# EAGLE design SNES-3Chip_MR_QID (EAGLE 7.5.0)
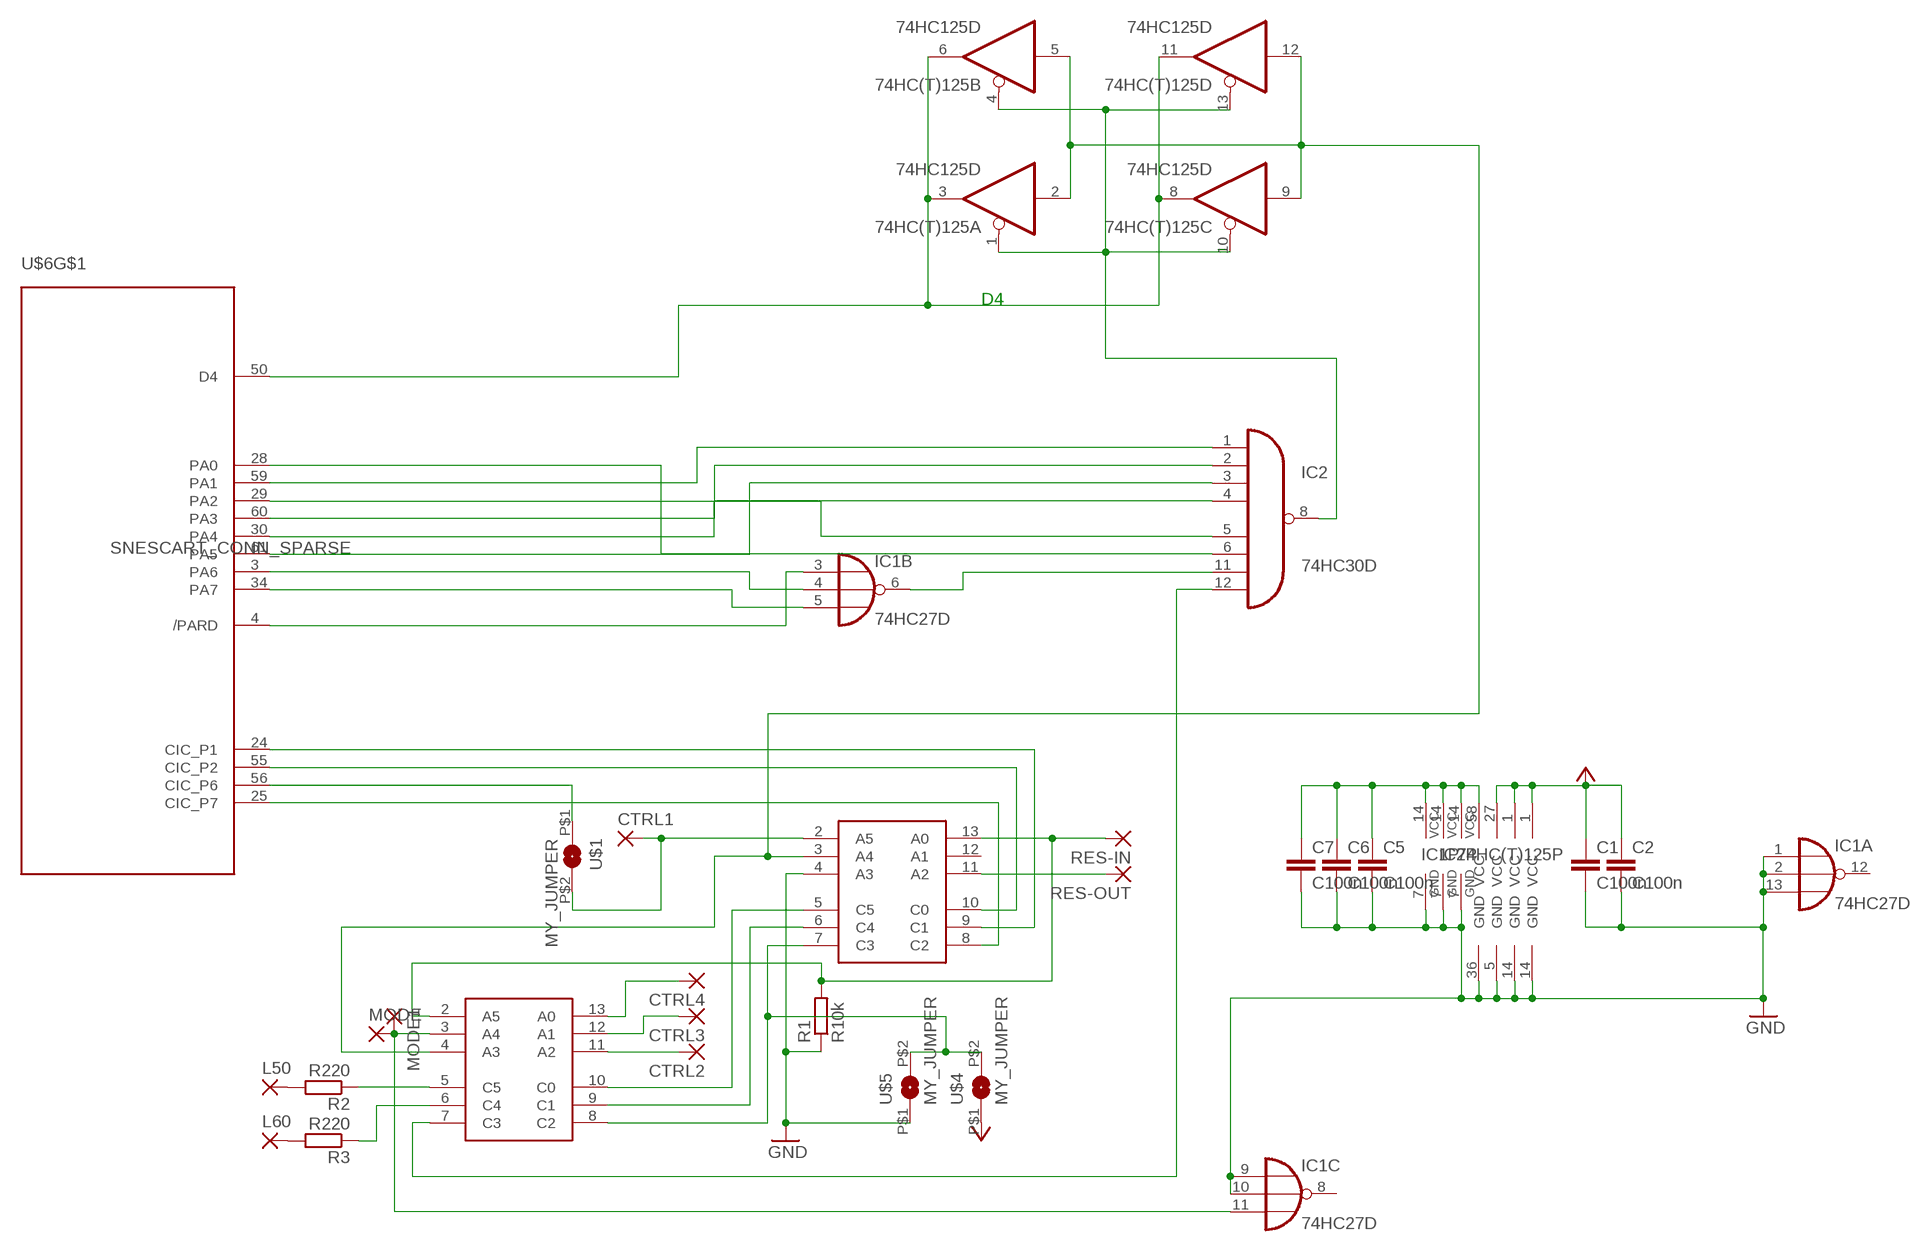
[diagram p0: schematic, sheet 1]

## Parts
74HC(T)125  74HC125D  [SO14]
C1  C100n  C0805  [Z0805]
C2  C100n  C0805  [Z0805]
C5  C100n  C0805  [Z0805]
C6  C100n  C0805  [Z0805]
C7  C100n  C0805  [Z0805]
CTRL1  SMD2  [SMD1,27-2,54]
CTRL2  SMD2  [SMD1,27-2,54]
CTRL3  SMD2  [SMD1,27-2,54]
CTRL4  SMD2  [SMD1,27-2,54]
IC1  74HC27D  [SO14]
IC2  74HC30D  [SO14]
L50  SMD2  [SMD1,27-2,54]
L60  SMD2  [SMD1,27-2,54]
MODE  SMD2  [SMD1,27-2,54]
MODE1  SMD2  [SMD1,27-2,54]
R1  R10k  R0805  [Z0805]
R2  R220  R0805  [Z0805]
R3  R220  R0805  [Z0805]
RES-IN  SMD2  [SMD1,27-2,54]
RES-OUT  SMD2  [SMD1,27-2,54]
U$1  MY_JUMPER  [MYJUMP]
U$2  PIC16F630_SIMPLE  [PIC16F630]
U$3  PIC16F630_SIMPLE  [PIC16F630]
U$4  MY_JUMPER  [MYJUMP]
U$5  MY_JUMPER  [MYJUMP]
U$6  SNESCART_CONN_SPARSE  [SNESCART_CONN_SPARSE]

## Nets
GND: 74HC(T)125.7(P:GND) C1.2 C2.2 C5.2 C6.2 C7.2 IC1.1(A:I0) IC1.2(A:I1) IC1.7(P:GND) IC1.9(C:I0) IC1.10(C:I1) IC1.13(A:I2) IC2.7(GND) R1.1 U$2.4(A3) U$2.14(GND) U$3.14(GND) U$5.P$1 U$6.5(GND) U$6.36(GND)
N$2: 74HC(T)125.1(A:OE) 74HC(T)125.4(B:OE) 74HC(T)125.10(C:OE) 74HC(T)125.13(D:OE) IC2.8(O)
N$3: RES-OUT.1(P) U$2.11(A2)
N$4: IC2.3(I2) U$6.61(PA5)
N$5: IC2.2(I1) U$6.60(PA3)
N$6: IC1.3(B:I0) U$6.4(/PARD)
N$7: IC1.4(B:I1) U$6.3(PA6)
N$8: IC1.6(B:O) IC2.11(I6)
N$9: IC2.6(I5) U$6.28(PA0)
N$10: R1.2 RES-IN.1(P) U$2.13(A0) U$3.2(A5)
N$11: L50.1(P) R2.2
N$12: R2.1 U$3.5(C5)
N$13: R3.1 U$3.6(C4)
N$14: IC1.11(C:I2) MODE1.1(P) MODE.1(P) U$3.3(A4)
N$15: L60.1(P) R3.2
N$16: IC1.5(B:I2) U$6.34(PA7)
N$17: IC2.12(I7) U$3.7(C3)
N$18: U$1.P$1 U$6.56(CIC_P6)
N$19: U$2.5(C5) U$3.10(C0)
N$20: IC2.1(I0) U$6.59(PA1)
N$21: IC2.5(I4) U$6.29(PA2)
N$22: IC2.4(I3) U$6.30(PA4)
N$33: CTRL2.1(P) U$3.11(A2)
N$34: CTRL3.1(P) U$3.12(A1)
N$39: CTRL1.1(P) U$1.P$2 U$2.2(A5)
N$42: 74HC(T)125.3(A:O) 74HC(T)125.6(B:O) 74HC(T)125.8(C:O) 74HC(T)125.11(D:O) U$6.50(D4)
N$46: CTRL4.1(P) U$3.13(A0)
N$48: U$2.10(C0) U$6.55(CIC_P2)
N$49: U$2.9(C1) U$6.24(CIC_P1)
N$51: U$2.8(C2) U$6.25(CIC_P7)
N$52: U$2.6(C4) U$3.9(C1)
N$53: U$2.7(C3) U$3.8(C2) U$4.P$2 U$5.P$2
UIGR: 74HC(T)125.2(A:I) 74HC(T)125.5(B:I) 74HC(T)125.9(C:I) 74HC(T)125.12(D:I) U$2.3(A4) U$3.4(A3)
VCC: C1.1 C2.1 U$2.1(VCC) U$3.1(VCC) U$4.P$1 U$6.27(VCC)
VCC_2: 74HC(T)125.14(P:VCC) C5.1 C6.1 C7.1 IC1.14(P:VCC) IC2.14(VCC) U$6.58(VCC)
Unconnected: IC1.8(C:O) IC1.12(A:O) U$2.12(A1)

## Notes on the sheet
- D4

## Library data of the parts
74HC(T)125 = 74xx-eu:74*125: Quad bus BUFFER, 3-state
C1 C2 C5-C7 = snescart:C0805
CTRL1-CTRL4 L50 L60 MODE MODE1 RES-IN RES-OUT = wirepad:SMD2: SMD PAD
IC1 = 74xx-eu:74*27: Triple 3-input NOR gate
IC2 = 74xx-eu:74*30: 8-input NAND gate
R1-R3 = snescart:R0805
U$1 U$4 U$5 = snescart:MY_JUMPER
U$2 U$3 = snescart:PIC16F630_SIMPLE
U$6 = snes_div:SNESCART_CONN_SPARSE

## Board
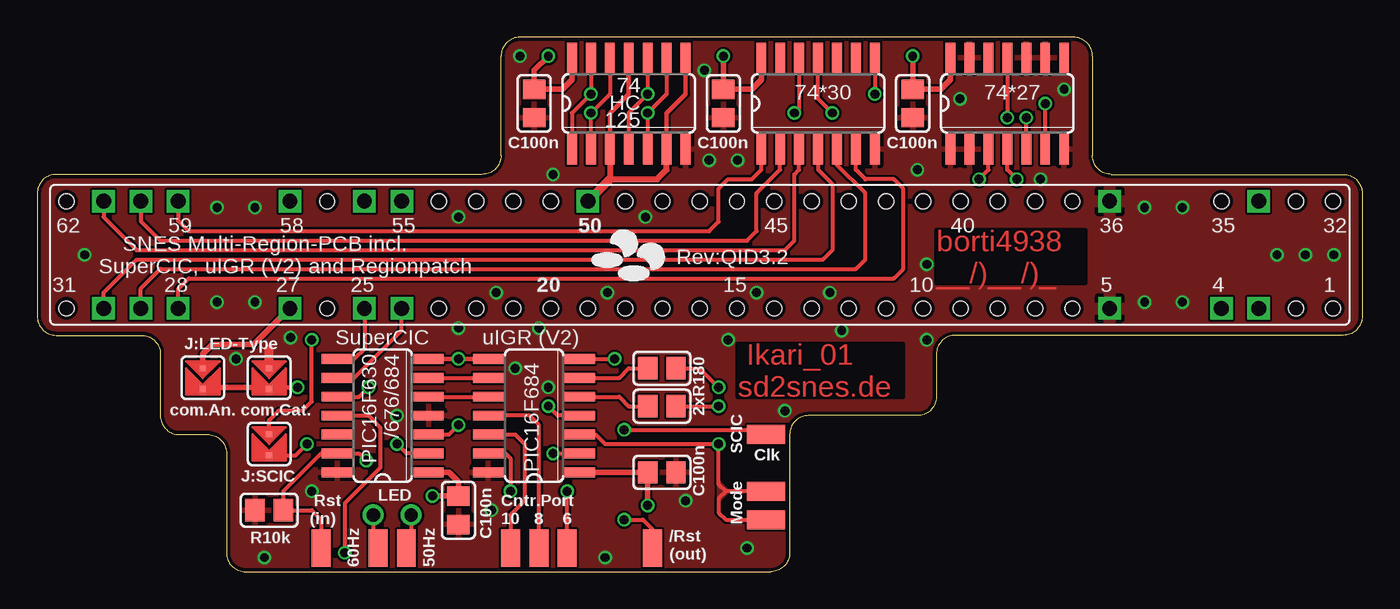
[diagram p1: board, top side]
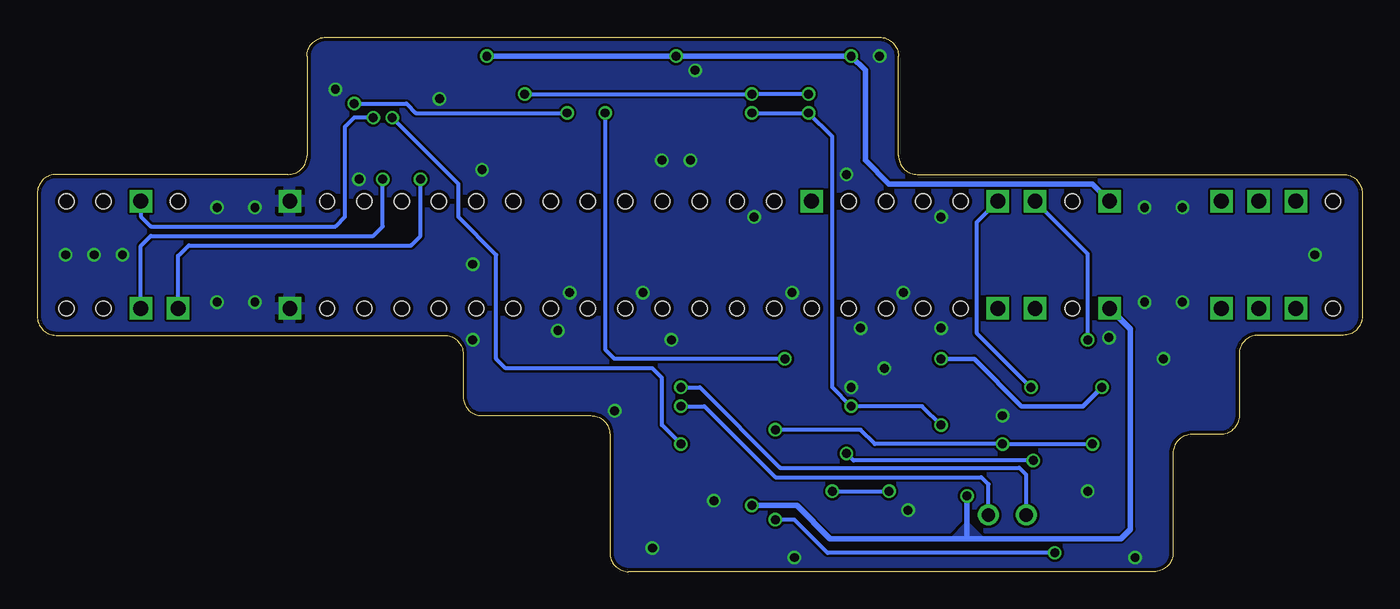
[diagram p2: board, bottom side, seen from below]

Size 88.9 x 35.88 mm. Coordinates in mm from the lower left corner, seen from the top.
Outline: 72.07,26.67 arc-90 70.8,27.94 70.8,34.61 arc90 69.53,35.88 32.38,35.88 arc90 31.11,34.61 31.11,27.94 arc-90 29.84,26.67 1.27,26.67 arc90 0,25.4 0,17.14 arc90 1.27,15.88 6.99,15.88 arc-90 8.26,14.61 8.26,10.48 arc90 9.53,9.21 11.43,9.21 arc-90 12.7,7.94 12.7,1.27 arc90 13.97,0 49.21,0 arc90 50.48,1.27 50.48,9.21 arc-90 51.75,10.48 59.05,10.48 arc90 60.32,11.75 60.32,14.61 arc-90 61.59,15.88 87.63,15.88 arc90 88.9,17.14 88.9,25.4 arc90 87.63,26.67 72.07,26.67
Copper layers (1*16): Top 0.035mm / dielectric 1.5mm / Bottom 0.035mm
Design rules "ITEADstudio_DRC": minimum track width 6mil, minimum drill 12mil, track to track 6mil, track to pad 6mil, pad to pad 6mil, via to via 6mil, smd to smd 0mil, copper to edge 10mil, drill to drill 10mil, minimum pad ring 10mil, minimum via ring 6mil, stop-mask expansion 2mil, vias tented up to drill 30mil, thermal gap 10mil
tRestrict: 3 lines

### Footprints (pad centres in the part's own frame; a part is rotated, then mirrored left to right if it is on the bottom)
SO14 = smd 0.66 x 2.032: 1 -3.81,-3.073; 2 -2.54,-3.073; 3 -1.27,-3.073; 4 0,-3.073; 5 1.27,-3.073; 6 2.54,-3.073; 7 3.81,-3.073; 8 3.81,3.073; 9 2.54,3.073; 10 1.27,3.073; 11 0,3.073; 12 -1.27,3.073; 13 -2.54,3.073; 14 -3.81,3.073
Z0805 = smd 1.3 x 1.5: 1 -0.95,0; 2 0.95,0
SMD1,27-2,54 = smd 1.27 x 2.54: 1 0,0
MYJUMP = smd 0.406 x 0.406: P$1 -0.635,0; P$2 0.765,0
PIC16F630 = smd 0.66 x 2.032: 1 -3.81,-3.073; 2 -2.54,-3.073; 3 -1.27,-3.073; 4 0,-3.073; 5 1.27,-3.073; 6 2.54,-3.073; 7 3.81,-3.073; 8 3.81,3.073; 9 2.54,3.073; 10 1.27,3.073; 11 0,3.073; 12 -1.27,3.073; 13 -2.54,3.073; 14 -3.81,3.073
SNESCART_CONN_SPARSE = drill 1 square: 3 -3.6,-37.5; 4 -3.6,-35; 5 -3.6,-27.5; 24 -3.6,20; 25 -3.6,22.5; 27 -3.6,27.5; 28 -3.6,35; 29 -3.6,37.5; 30 -3.6,40; 34 3.6,-37.5; 36 3.6,-27.5; 50 3.6,7.5; 55 3.6,20; 56 3.6,22.5; 58 3.6,27.5; 59 3.6,35; 60 3.6,37.5; 61 3.6,40 | hole 1: -3.6,-42.5; -3.6,-40; -3.6,-25; -3.6,-22.5; -3.6,-20; -3.6,-17.5; -3.6,-15; -3.6,-12.5; -3.6,-10; -3.6,-7.5; -3.6,-5; -3.6,-2.5; -3.6,0; -3.6,2.5; -3.6,5; -3.6,7.5; -3.6,10; -3.6,12.5; -3.6,15; -3.6,17.5; -3.6,25; -3.6,42.5; 3.6,42.5; 3.6,25; 3.6,17.5; 3.6,15; 3.6,12.5; 3.6,10; 3.6,5; 3.6,2.5; 3.6,0; 3.6,-2.5; 3.6,-5; 3.6,-7.5; 3.6,-10; 3.6,-12.5; 3.6,-15; 3.6,-17.5; 3.6,-20; 3.6,-22.5; 3.6,-25; 3.6,-35; 3.6,-40; 3.6,-42.5

### Placement (x,y rotation side)
74HC(T)125  39.69,31.43 0 top
C1  41.91,6.67 0 top
C2  28.26,4.13 270 top
C5  33.34,31.43 270 top
C6  46.04,31.43 270 top
C7  58.74,31.43 270 top
CTRL1  48.89,9.21 90 top
CTRL2  33.65,1.59 0 top
CTRL3  31.75,1.59 0 top
CTRL4  35.56,1.59 0 top
IC1  65.09,31.43 0 top
IC2  52.39,31.43 0 top
L50  24.77,1.59 0 top
L60  22.86,1.59 0 top
MODE  48.89,3.49 90 top
MODE1  48.89,5.4 90 top
R1  15.56,4.13 0 top
R2  41.91,11.11 0 top
R3  41.91,13.65 0 top
RES-IN  19.05,1.59 0 top
RES-OUT  41.27,1.59 180 top
U$1  15.56,8.57 270 top
U$2  23.18,10.48 90 top
U$3  33.34,10.48 90 top
U$4  11.11,13.02 270 top
U$5  15.56,13.02 270 top
U$6  44.45,21.27 90 top

### Tracks (layer width: path | path; a pad name or v marks a point on that pad's centre or on a via)
GND  (via drill 0.6)
  Top 0.61: U$5.P$1 15.56,14.92
  other vias: 24.13,10.48 83.19,21.27 87,21.27 47.62,1.59 76.84,18.1 68.9,32.39 34.61,26.67 3.18,21.27 46.35,15.56 74.3,18.1 85.09,21.27 45.08,27.62 13.34,14.29 12.07,24.45 15.24,0.95 12.07,18.1 14.61,24.45 28.26,23.81 59.05,26.99 74.3,24.45 53.18,18.73 53.97,16.19 34.29,12.38 32.07,13.65 46.99,27.62 50.16,10.79 16.99,15.72 38.1,0.95 76.84,24.45 14.61,18.1 30.8,18.73 43.5,4.76 67.31,26.35 61.91,31.75 44.77,33.66 48.26,18.73 18.41,5.4 30.48,4.13 32.38,34.61 38.26,18.73 40.8,23.81 28.26,16.35 33.65,16.35 59.69,15.56 59.69,20.64
  pour Top (rank 2): -1.27,-6.67 90.17,-6.67 90.17,39.05 -1.27,39.05
  pour Bottom (rank 2): -1.27,39.05 90.17,39.05 90.17,-6.67 -1.27,-6.67
  pour Bottom: 70.48,26.35 73.66,26.35 73.66,16.19 70.48,16.19
  pour Top: 70.48,26.35 73.66,26.35 73.66,16.19 70.48,16.19
N$2  (via drill 0.6)
  Top 0.254: 74HC(T)125.13 v37.15,32.07 35.88,30.8 74HC(T)125.1 | 74HC(T)125.10 v40.96,32.07 39.69,30.8 74HC(T)125.4 | IC2.8 v56.2,32.07
  Bottom 0.254: v37.15,32.07 v40.96,32.07 v56.2,32.07
N$3  (via drill 0.6)
  Top 0.254: U$2.11 22.23,10.48 23.02,9.68 23.02,6.98 20.64,4.6 v20.64,1.27 | v39.37,3.49 40.64,3.49 41.27,2.86 RES-OUT.1
  Bottom 0.254: v20.64,1.27 35.88,1.27 38.1,3.49 v39.37,3.49
N$4
  Top 0.254: U$6.61 4.45,23.81 6.67,21.59 50.16,21.59 50.8,22.22 50.8,26.67 51.12,26.99 IC2.3
  Top 0.305: U$6.61
N$5
  Top 0.254: U$6.60 6.95,23.53 8.26,22.22 47.62,22.22 48.26,22.86 48.26,25.4 49.85,26.99 IC2.2
N$6  (via drill 0.6)
  Top 0.254: v63.18,26.35 63.82,26.99 IC1.3
  Bottom 0.254: U$6.4 79.45,21.2 78.74,21.91 63.82,21.91 63.18,22.54 v63.18,26.35
N$7  (via drill 0.6)
  Top 0.254: v65.72,26.35 65.09,26.99 IC1.4
  Bottom 0.254: U$6.3 81.95,21.87 81.28,22.54 66.36,22.54 65.72,23.18 v65.72,26.35
N$8  (via drill 0.6)
  Top 0.254: v53.34,30.8 52.39,31.75 IC2.11 | IC1.6 v67.63,31.43
  Bottom 0.254: v67.63,31.43 64.14,31.43 63.5,30.8 v53.34,30.8
N$9
  Top 0.254: U$6.28 9.45,18.97 10.16,19.68 57.47,19.68 58.1,20.32 58.1,25.72 57.47,26.35 55.56,26.35 54.93,26.99 IC2.6
N$10  (via drill 0.6)
  Top 0.254: RES-IN.1 19.05,3.49 18.41,4.13 R1.2 16.51,5.4 19.05,7.94 U$2.13 21.59,7.94 v22.07,7.46 | v34.61,7.94 U$3.2
  Bottom 0.254: v22.07,7.46 34.13,7.46 v34.61,7.94
N$11  (via drill 0.6, 0.9 pad 1.42)
  Top 0.254: R2.2 v45.72,11.11 | v25.08,3.81 25.08,1.9 L50.1
  Bottom 0.254: v45.72,11.11 44.13,11.11 39.37,6.35 25.56,6.35 25.08,5.87 v25.08,3.81
N$12
  Top 0.254: U$3.5 39.05,11.75 39.69,11.11 R2.1
N$13
  Top 0.254: U$3.6 39.05,13.02 39.69,13.65 R3.1
N$14  (via drill 0.6)
  Top 0.254: U$3.3 37.46,9.21 38.1,8.57 v45.72,8.57 45.72,5.87 46.2,5.4 | IC1.11 v65.09,30.48 | 46.2,5.4 45.72,4.92 45.72,3.97 46.2,3.49 MODE.1 | MODE1.1 46.2,5.4
  Bottom 0.254: v65.09,30.48 60.64,26.04 60.64,23.81 58.1,21.27 58.1,14.29 57.47,13.65 47.62,13.65 46.99,13.02 46.99,9.84 v45.72,8.57
  pour Top: 45.72,6.03 45.72,4.76 46.35,5.4
N$15  (via drill 0.6, 0.9 pad 1.42)
  Top 0.254: R3.2 44.45,13.65 v45.72,12.38 | v22.54,3.81 22.54,1.9 L60.1
  Bottom 0.254: v45.72,12.38 44.45,12.38 39.05,6.98 23.02,6.98 22.54,6.51 v22.54,3.81
N$16  (via drill 0.6)
  Top 0.254: IC1.5 v66.36,30.48
  Bottom 0.254: v66.36,30.48 67.63,30.48 68.26,29.85 68.26,23.81 68.9,23.18 81.28,23.18 81.95,23.85 U$6.34
N$17  (via drill 0.6)
  Top 0.254: U$3.7 v38.73,14.29 | IC2.12 51.12,31.11 v50.8,30.8
  Bottom 0.254: v38.73,14.29 50.16,14.29 50.8,14.92 v50.8,30.8
N$18  (via drill 0.6)
  Top 0.254: U$1.P$1 15.56,10.16 16.19,10.79 17.78,10.79 18.41,11.43 v18.41,15.56
  Bottom 0.254: v18.41,15.56 18.41,21.34 U$6.56
N$19
  Top 0.254: U$2.5 U$3.10
N$20
  Top 0.254: U$6.59 9.45,23.57 10.16,22.86 45.08,22.86 45.72,23.5 45.72,25.72 46.35,26.35 47.94,26.35 48.58,26.99 IC2.1
N$21
  Top 0.254: U$6.29 6.95,19.02 8.26,20.32 54.93,20.32 55.56,20.95 55.56,25.4 53.66,27.3 IC2.5
N$22
  Top 0.254: U$6.30 4.45,18.74 6.67,20.95 52.7,20.95 53.34,21.59 53.34,26.04 52.39,26.99 IC2.4
N$33
  Top 0.254: CTRL2.1 33.65,9.84 33.02,10.48 U$3.11
N$34
  Top 0.254: U$3.12 32.07,9.21 32.7,8.57 32.7,4.76 31.75,3.81 CTRL3.1
N$39  (via drill 0.6)
  Top 0.254: U$2.2 24.77,7.94 v24.13,8.57 | U$1.P$2 17.33,7.81 v18.1,8.57 | v39.37,9.52 48.58,9.52 CTRL1.1
  Bottom 0.254: v18.1,8.57 v24.13,8.57 32.7,8.57 33.65,9.52 v39.37,9.52
N$42
  Top 0.305: 74HC(T)125.3 38.42,30.8 39.69,32.07 74HC(T)125.11 | 74HC(T)125.6 42.23,30.8 43.5,32.07 74HC(T)125.8 43.5,34.29
  Top 0.406: 74HC(T)125.6 42.23,26.99 41.59,26.35 38.42,26.35 74HC(T)125.3
  Top 0.61: U$6.50 36.95,24.88 38.42,26.35
N$46  (via drill 0.6)
  Top 0.254: U$3.13 31.43,7.94 31.75,7.62 v31.75,5.4 | CTRL4.1 v35.56,5.4
  Bottom 0.254: v35.56,5.4 v31.75,5.4
N$48  (via drill 0.6)
  Top 0.254: U$2.10 21.59,11.75 v22.23,12.38
  Bottom 0.254: U$6.55 25.88,23.45 25.88,16.03 v22.23,12.38
N$49
  Top 0.254: U$2.9 21.27,13.02 24.45,16.19 U$6.24
N$51
  Top 0.254: U$6.25 21.95,14.97 21.27,14.29 U$2.8
N$52
  Top 0.254: U$2.6 U$3.9
N$53  (via drill 0.6)
  Top 0.305: U$2.7 v28.26,14.29 U$3.8 | v17.46,12.38 15.88,12.38 15.75,12.25 U$5.P$2 15.43,12.38 | U$4.P$2 11.3,12.25 11.43,12.38
  Top 0.356: 11.43,12.38 15.43,12.38
  Bottom 0.305: v17.46,12.38 18.73,11.11 22.86,11.11 26.04,14.29 v28.26,14.29
UIGR  (via drill 0.6)
  Top 0.254: 74HC(T)125.9 42.23,32.07 v40.96,30.8 74HC(T)125.5 | 74HC(T)125.2 v37.15,30.8 38.42,32.07 74HC(T)125.12 | U$2.3 27.62,9.21 v28.26,9.84 | U$3.4 34.92,10.48 v34.29,11.11
  Bottom 0.254: v28.26,9.84 29.53,11.11 v34.29,11.11 35.56,12.38 35.56,29.21 v37.15,30.8 v40.96,30.8
VCC  (via drill 0.6)
  Top 0.356: U$3.1 C1.1 v40.96,4.45 | U$2.1 27.62,6.67 28.26,6.03 C2.1 26.99,5.08 v26.51,5.08 | U$4.P$1 11.11,14.61 11.75,15.24 14.52,15.24 U$6.27
  Bottom 0.305: v40.96,4.45
  Bottom 0.356: U$6.27 15.56,16.28 15.56,2.86 16.19,2.22 26.51,2.22 | 26.51,2.22 35.72,2.22 37.94,4.45 v40.96,4.45 | v26.51,5.08 26.51,2.22
  pour Bottom: 25.56,2.22 26.51,3.17 27.46,2.22
VCC_2  (via drill 0.6)
  Top 0.305: C7.1 | C5.1 | C6.1
  Top 0.356: v58.74,34.61 C7.1 | IC1.14 61.28,33.02 60.64,32.39 C7.1 | IC2.14 48.58,33.02 47.94,32.39 C6.1 | 74HC(T)125.14 35.88,33.02 35.24,32.39 C5.1 33.34,33.65 v34.29,34.61 | C6.1 v46.04,34.61
  Bottom 0.254: U$6.58 16.95,24.89
  Bottom 0.356: v58.74,34.61 v46.04,34.61 v34.29,34.61 33.34,33.65 33.34,27.62 31.75,26.04 18.1,26.04 16.95,24.89

### Text on the board
Top: borti4938 / __/)__/)_ | Ikari_01 / sd2snes.de
tNames: 74 / HC / 125 | 74*30 | 74*27 | C100n | C100n | C100n | SNES Multi-Region-PCB incl. / SuperCIC, uIGR (V2) and Regionpatch | Rev:QID3.2 | J:LED-Type | SuperCIC | uIGR (V2) | PIC16F630 / /676/684 | com.An. | com.Cat. | 2xR180 | SCIC | Clk | J:SCIC | PIC16F684 | LED | Rst / (in) | Cntr.Port / 10 | 8 | 6 | Mode | C100n | 60Hz | 50Hz | /Rst / (out)
tStop: b | o | r | t | i | 4 | 9 | 3 | 8 | _ | _ | / | ) | _ | _ | / | ) | _ | I | k | a | r | i | _ | 0 | 1 | s | d | 2 | s | n | e | s | . | d | e